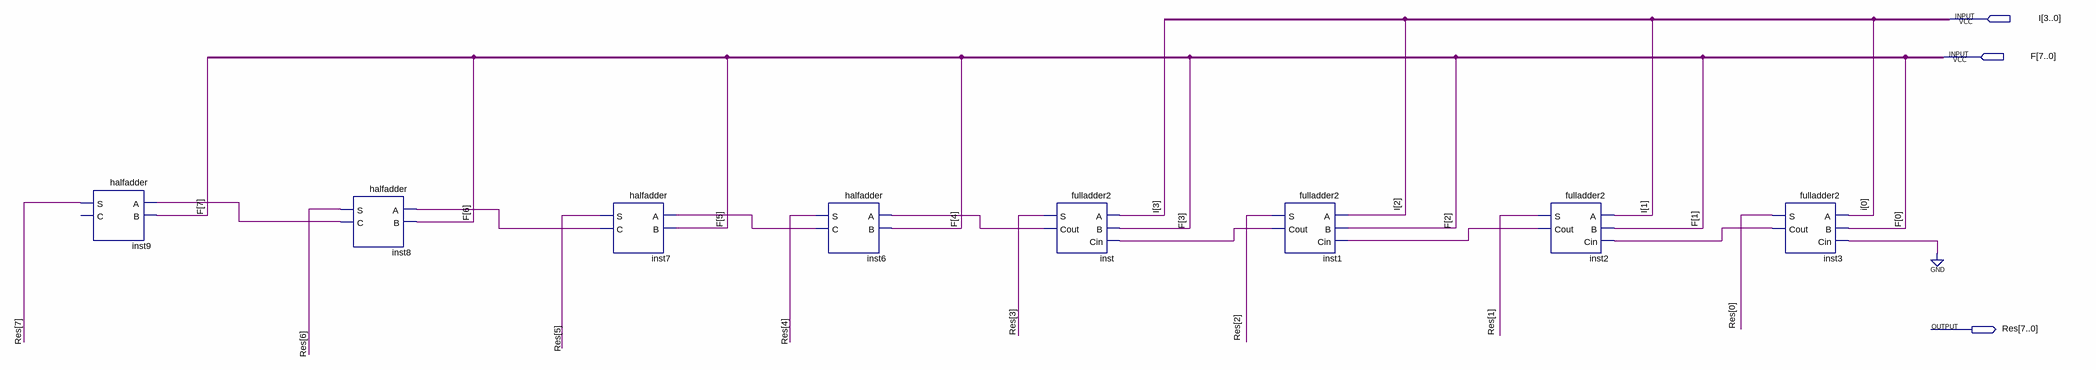
[diagram p0: schematic sheet]
// Quartus schematic Adder8_4bits.bdf as structural Verilog: 8 symbols, 3 pins
module Adder8_4bits (
  input  [3:0] I,
  input  [7:0] F,
  output [7:0] Res
);

  wire inst1_cout, inst2_cout, inst3_cout, inst6_c, inst7_c, inst8_c, inst_cout;

  halfadder inst9 (.A(inst8_c), .B(F[7]), .S(Res[7]));  // open: C
  halfadder inst8 (.A(inst7_c), .B(F[6]), .S(Res[6]), .C(inst8_c));
  halfadder inst7 (.A(inst6_c), .B(F[5]), .S(Res[5]), .C(inst7_c));
  halfadder inst6 (.A(inst_cout), .B(F[4]), .S(Res[4]), .C(inst6_c));
  fulladder2 inst (.A(I[3]), .B(F[3]), .Cin(inst1_cout), .S(Res[3]), .Cout(inst_cout));
  fulladder2 inst1 (.A(I[2]), .B(F[2]), .Cin(inst2_cout), .S(Res[2]), .Cout(inst1_cout));
  fulladder2 inst2 (.A(I[1]), .B(F[1]), .Cin(inst3_cout), .S(Res[1]), .Cout(inst2_cout));
  fulladder2 inst3 (.A(I[0]), .B(F[0]), .Cin(1'b0), .S(Res[0]), .Cout(inst3_cout));
endmodule
